# Altium project DM1097_R1M1E1.PrjPcb (part 12 of 12)

## Sheet DM1097_IMU.SchDoc: =project_title
size Tabloid; CompanyName: Luxonis Holding; DrawnBy: David Malovrh; Organization: Luxonis Holding; Address1: 1925 Harmony Park Drive; Address2: Westminster, CO; Address3: 80234; Address4: United States; DocumentNumber: D0000200; Revision: R1M1E1; SheetNumber: 10; SheetTotal: 12
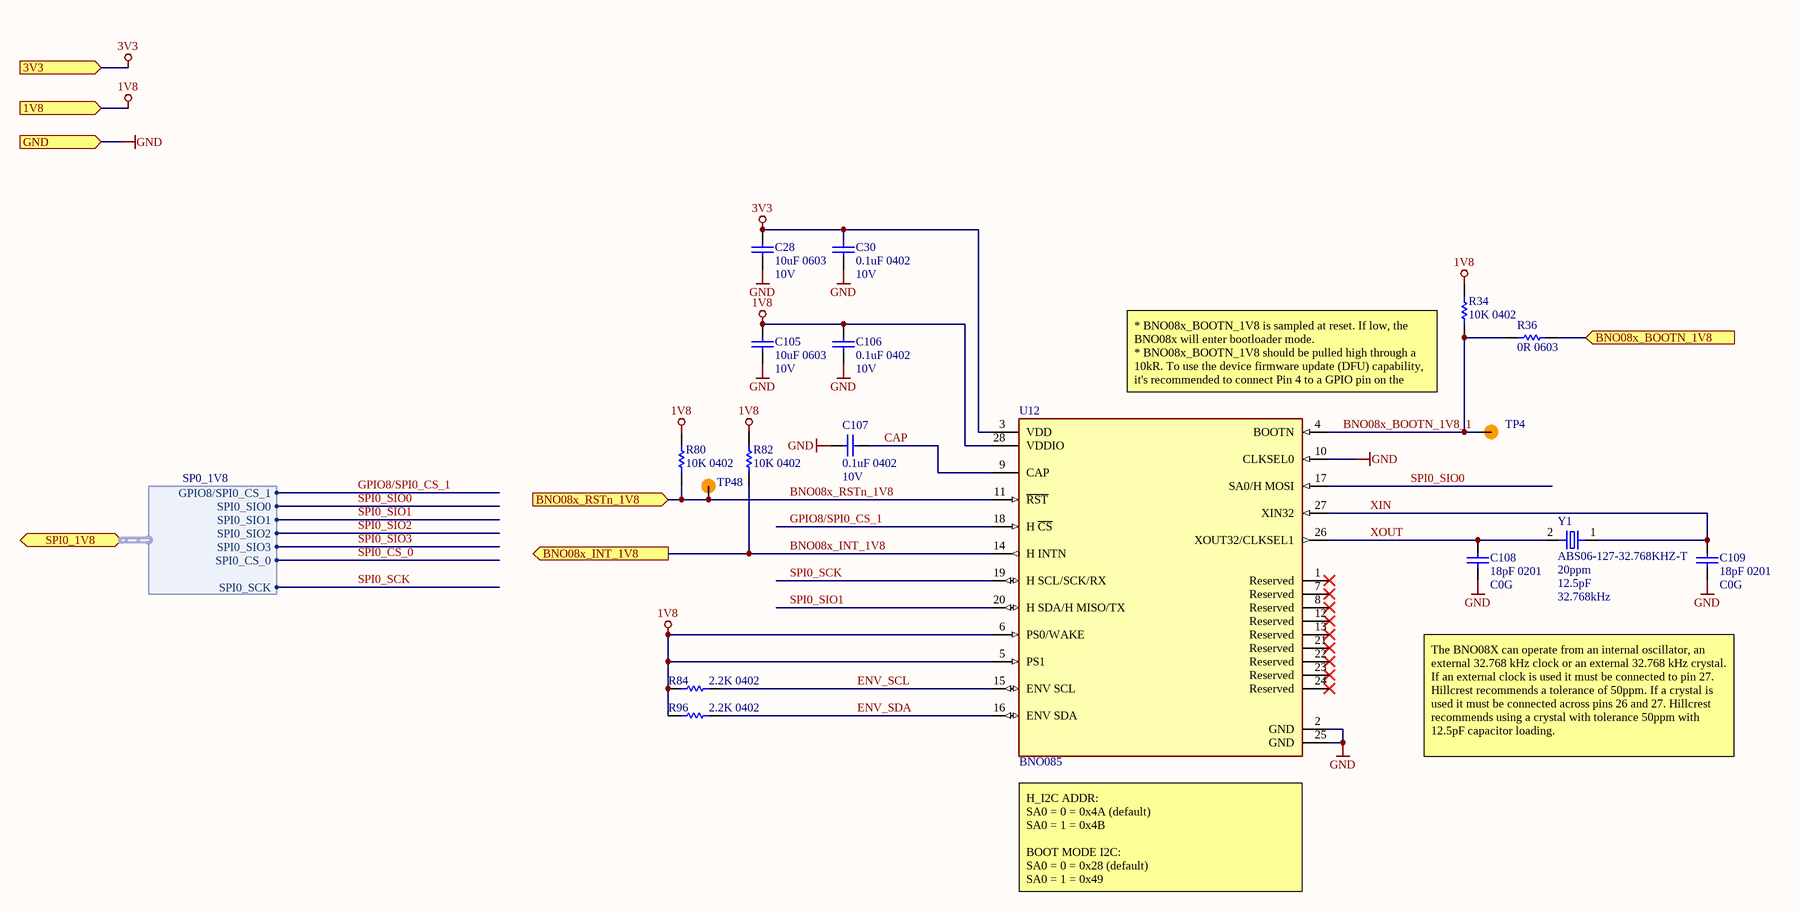
[diagram p16: DM1097_IMU.SchDoc]

### Parts
C28  10uF 0603  Voltage Rating: 10V  [CAPC0603(1608)100_N]
C30  0.1uF 0402  Voltage Rating: 10V  [CAPC0402(1005)70_N]
C105  10uF 0603  Voltage Rating: 10V  [CAPC0603(1608)100_N]
C106  0.1uF 0402  Voltage Rating: 10V  [CAPC0402(1005)70_N]
C107  0.1uF 0402  Voltage Rating: 10V  [CAPC0402(1005)70_N]
C108  18pF 0201  Dielectric: C0G  [CAPC0201(0603)33_N]
C109  18pF 0201  Dielectric: C0G  [CAPC0201(0603)33_N]
R34  10K 0402  [RESC0402(1005)_N]
R36  0R 0603  [RESC0603(1608)_N]
R80  10K 0402  [RESC0402(1005)_N]
R82  10K 0402  [RESC0402(1005)_N]
R84  2.2K 0402  [RESC0402(1005)_N]
R96  2.2K 0402  [RESC0402(1005)_N]
TP4  TP100_200_NS  [TP100_200_NS]  (value not drawn)  (no BOM)
TP48  TP100_200_NS  [TP100_200_NS]  (value not drawn)  (no BOM)
U12  BNO085  [BNO085]
Y1  ABS06-127-32.768KHZ-T  Frequency Tolerance: 20ppm  Load Capacitance: 12.5pF  Frequency: 32.768kHz  [ABS06-127-32.768KHZ-T]

### Ports
1V8 (in), 3V3 (in), BNO08x_BOOTN_1V8 (in), BNO08x_INT_1V8 (out), BNO08x_RSTn_1V8 (in), GND (in), SPI0_1V8 (bidir, harness SP0_1V8)

### Harnesses
SP0_1V8: SPI0_SIO1, SPI0_SIO2, SPI0_SIO3, GPIO8/SPI0_CS_1, SPI0_SIO0, SPI0_CS_0, SPI0_SCK

### Nets
1V8: C105.2 C106.2 R34.2 R80.2 R82.2 R84.1 R96.1 U12.5(PS1) U12.6(PS0/WAKE) U12.28(VDDIO) ; port 1V8
3V3: C28.2 C30.2 U12.3(VDD) ; port 3V3
GND: C28.1 C30.1 C105.1 C106.1 C107.2 C108.1 C109.1 U12.2(GND) U12.10(CLKSEL0) U12.25(GND) ; port GND
BNO08x_BOOTN_1V8_1: R34.1 R36.1 TP4.1 U12.4(BOOTN)
BNO08x_INT_1V8: R82.1 U12.14(H_INTN) ; port BNO08x_INT_1V8  [project net AUX_IO_IRQ]
BNO08x_RSTn_1V8: R80.1 TP48.1 U12.11(~{RST}) ; port BNO08x_RSTn_1V8
CAP: C107.1 U12.9(CAP)
ENV_SCL: R84.2 U12.15(ENV_SCL)
ENV_SDA: R96.2 U12.16(ENV_SDA)
GPIO8/SPI0_CS_1: U12.18(H_~{CS}) ; port SPI0_1V8.GPIO8/SPI0_CS_1
SPI0_SCK: U12.19(H_SCL/SCK/RX) ; port SPI0_1V8.SPI0_SCK
SPI0_SIO0: U12.17(SA0/H_MOSI) ; port SPI0_1V8.SPI0_SIO0
SPI0_SIO1: U12.20(H_SDA/H_MISO/TX) ; port SPI0_1V8.SPI0_SIO1
XIN: C109.2 U12.27(XIN32) Y1.1
XOUT: C108.2 U12.26(XOUT32/CLKSEL1) Y1.2
NetJ21_42: R36.2 ; port BNO08x_BOOTN_1V8

Not connected (* = marked no-connect by the designer): U12 1(Reserved)* 7(Reserved)* 8(Reserved)* 12(Reserved)* 13(Reserved)* 21(Reserved)* 22(Reserved)* 23(Reserved)* 24(Reserved)*

### Notes on the sheet
- * BNO08x_BOOTN_1V8 is sampled at reset. If low, the BNO08x will enter bootloader mode.
  * BNO08x_BOOTN_1V8 should be pulled high through a 10kR. To use the device firmware update (DFU) capability, it's recommended to connect Pin 4 to a GPIO pin on the external uC.
- The BNO08X can operate from an internal oscillator, an external 32.768 kHz clock or an external 32.768 kHz crystal. If an external clock is used it must be connected to pin 27. Hillcrest recommends a tolerance of 50ppm. If a crystal is used it must be connected across pins 26 and 27. Hillcrest recommends using a crystal with tolerance 50ppm with 12.5pF capacitor loading.
- (near U12) H_I2C ADDR:
  SA0 = 0 = 0x4A (default)
  SA0 = 1 = 0x4B
  BOOT MODE I2C:
  SA0 = 0 = 0x28 (default)
  SA0 = 1 = 0x49
- Title
- Size:
- Date:
- Tabloid
- Number:
- Time:
- Revision:
- Sheet
- of
- Drawn by:

### Library data of the parts
C28 C105 = GRM188R61A106ME69D: CAP CER 10UF 10V X5R 0603 20%; Manufacturer 1: Murata; Material: Ceramic; Supplier 1: Digi-Key; Manufacturer Part Number 1: GRM188R61A106ME69D; Stock 1: 2873098; Pricing 1: 1=0.21000, 10=0.14100, 100=0.07130, 500=0.04876, 1000=0.04313 (USD); RoHS: Yes; Mount: Surface Mount; Case/Package: 0603; Weight: 0.000222oz; Case Code (Metric): 1608; Case Code (Imperial): 0603; Min Operating Temperature: -55°C; Max Operating Temperature: 85°C; Packaging: Tape and Reel; Tolerance: 20%; Capacitance: 10uF; Dielectric: X5R; Voltage Rating (DC): 10V; Package Quantity: 4000; Termination: SMD/SMT; Length: 1.6mm; Height: 0.8mm; Width: 0.8mm; Thickness: 0.035inch; Depth: 0.8mm; REACH SVHC: Unknown; Lead Free: Lead Free; ComponentLink1URL: http://www.mouser.com/ds/2/281/c02e-2905.pdf?src-supplier=Mouser; ComponentLink1Description: http://www.mouser.com/ds/2/281/c02e-2905.pdf?src-supplier=Mouser; ComponentLink2URL: http://components.arrow.com/part/dataview/0323_06119472?src-supplier=Arrow+Europe; ComponentLink2Description: http://components.arrow.com/part/dataview/0323_06119472?src-supplier=Arrow+Europe; ComponentLink3URL: http://www.farnell.com/datasheets/2048014.pdf?src-supplier=Farnell; ComponentLink3Description: http://www.farnell.com/datasheets/2048014.pdf?src-supplier=Farnell; ComponentLink4URL: http://www.farnell.com/datasheets/1872210.pdf?src-supplier=Farnell; ComponentLink4Description: http://www.farnell.com/datasheets/1872210.pdf?src-supplier=Farnell; ComponentLink5URL: http://search.murata.co.jp/Ceramy/image/img/A01X/G101/ENG/GRM188R61A106ME69-01.pdf?src-supplier=Digi-Key; ComponentLink5Description: http://search.murata.co.jp/Ceramy/image/img/A01X/G101/ENG/GRM188R61A106ME69-01.pdf?src-supplier=Digi-Key; ComponentLink6URL: http://www.farnell.com/datasheets/1872210.pdf?src-supplier=Newark; ComponentLink6Description: http://www.farnell.com/datasheets/1872210.pdf?src-supplier=Newark; ComponentLink7URL: http://www.farnell.com/datasheets/2048014.pdf?src-supplier=Element14; ComponentLink7Description: http://www.farnell.com/datasheets/2048014.pdf?src-supplier=Element14; ComponentLink8URL: http://www.farnell.com/datasheets/2048014.pdf?src-supplier=Newark; ComponentLink8Description: http://www.farnell.com/datasheets/2048014.pdf?src-supplier=Newark; Supplier Part Number 1: 490-10475-1-ND
C30 C106 C107 = GRM155R71A104JA01D: CAP CER 0.1UF 10V X7R 0402 5%; Manufacturer 1: Murata; Capacitance: 100nF; Supplier 1: Digi-Key; Manufacturer Part Number 1: GRM155R71A104JA01D; Stock 1: 1346709; Pricing 1: 1=0.10000, 10=0.02500, 100=0.01130, 500=0.00806, 1000=0.00633, 2500=0.00575, 5000=0.00529 (USD); RoHS: Yes; Mount: Surface Mount; Case/Package: 0402; Case Code (Imperial): 0402; Case Code (Metric): 1005; Min Operating Temperature: -55°C; Max Operating Temperature: 125°C; Tolerance: 5%; Packaging: Tape and Reel; Voltage Rating (DC): 10V; Dielectric: X7R; Package Quantity: 10000; Termination: SMD/SMT; Length: 1mm; Height: 0.5mm; Width: 0.02inch; Thickness: 0.022inch; Depth: 0.5mm; Radiation Hardening: No; Lead Free: Lead Free; ComponentLink1URL: https://datasheet.ciiva.com/5411/product-5411135.pdf?src-supplier=Mouser; ComponentLink1Description: https://datasheet.ciiva.com/5411/product-5411135.pdf?src-supplier=Mouser; ComponentLink2URL: https://datasheet.ciiva.com/11618/c02e-11618821.pdf?src-supplier=Avnet; ComponentLink2Description: https://datasheet.ciiva.com/11618/c02e-11618821.pdf?src-supplier=Avnet; Supplier Part Number 1: 490-10777-1-ND
C108 C109 = GRM0335C1E180FA01D: Cap Ceramic 18pF 25V C0G 1% Pad SMD 0201 125C T/R; Manufacturer 1: Murata; Supplier 1: Digi-Key; Manufacturer Part Number 1: GRM0335C1E180FA01D; RoHS: Yes; Category: Ceramic Capacitors; Stock 1: 27511; Pricing 1: 1=0.10000, 10=0.02100, 100=0.00930, 500=0.00666, 1000=0.00523, 2500=0.00476, 5000=0.00438 (USD); Mount: Surface Mount; Case/Package: 0201; Case Code (Imperial): 0201; Case Code (Metric): 0603; Min Operating Temperature: -55°C; Max Operating Temperature: 125°C; Capacitance: 18pF; Tolerance: 1%; Packaging: Tape and Reel; Voltage Rating (DC): 25V; Package Quantity: 15000; Voltage Rating: 25V; Termination: SMD/SMT; Length: 0.024inch; Height: 0.3mm; Thickness: 0.013inch; Width: 0.3mm; ComponentLink1URL: https://datasheet.ciiva.com/29538/partnumbering-e-01-29538328.pdf?src-supplier=Digi-Key; ComponentLink1Description: https://datasheet.ciiva.com/29538/partnumbering-e-01-29538328.pdf?src-supplier=Digi-Key; Supplier 2: Digi-Key; Supplier 3: Mouser; Supplier Part Number 3: 81-GRM0335C1E180FA1D; Supplier Part Number 2: 490-17804-2-ND; Supplier Part Number 1: 490-17804-1-ND
R34 R80 R82 = RC0402FR-1310KL: RES SMD 10K OHM 1% 0402 1/16W Chip Resistor, 0402 [1005 Metric], 10 kohm, RC Series, 50 V, Thick Film, 62.5 mW; Manufacturer 1: Yageo; Resistance: 10kR; Temperature Coefficient: 100ppm/°C; Power Rating: 62.5mW; Voltage Rating: 50V; ComponentLink1URL: https://datasheet.ciiva.com/16940/pyu-rc0402-51-rohs-l-6-16940293.pdf?src-supplier=Avnet+Europe; ComponentLink1Description: https://datasheet.ciiva.com/16940/pyu-rc0402-51-rohs-l-6-16940293.pdf?src-supplier=Avnet+Europe; ComponentLink2URL: https://datasheet.ciiva.com/28386/pyu-rc0402-51-rohs-l-6-28386855.pdf?src-supplier=Avnet+Europe; ComponentLink2Description: https://datasheet.ciiva.com/28386/pyu-rc0402-51-rohs-l-6-28386855.pdf?src-supplier=Avnet+Europe; ComponentLink3URL: https://datasheet.ciiva.com/16740/pyu-rc0402-51-rohs-l-6-r-16740602.pdf?src-supplier=Future+Electronics; ComponentLink3Description: https://datasheet.ciiva.com/16740/pyu-rc0402-51-rohs-l-6-r-16740602.pdf?src-supplier=Future+Electronics; ComponentLink4URL: https://datasheet.ciiva.com/8891/pyu-rc0402-51-rohs-l-6-8891339.pdf?src-supplier=Avnet; ComponentLink4Description: https://datasheet.ciiva.com/8891/pyu-rc0402-51-rohs-l-6-8891339.pdf?src-supplier=Avnet; ComponentLink5URL: https://datasheet.ciiva.com/5557/pyu-rc0402-51-rohs-l-6-r-5557997.pdf?src-supplier=Mouser; ComponentLink5Description: https://datasheet.ciiva.com/5557/pyu-rc0402-51-rohs-l-6-r-5557997.pdf?src-supplier=Mouser; ComponentLink6URL: https://datasheet.ciiva.com/7983/1018594-7983533.pdf?src-supplier=Element14; ComponentLink6Description: https://datasheet.ciiva.com/7983/1018594-7983533.pdf?src-supplier=Element14; Supplier 1: Newark; Manufacturer Part Number 1: RC0402FR-1310KL; Stock 1: 62239; Pricing 1: 1=0.10000, 25=0.01200, 100=0.00400, 250=0.00400, 500=0.00300, 1000=0.00300 (USD); RoHS: Yes; Case/Package: 0402; Number of Pins: 2; Contact Plating: Tin,Matte,Lead; Case Code (Imperial): 0402; Case Code (Metric): 1005; Min Operating Temperature: -55°C; Max Operating Temperature: 155°C; Tolerance: 1%; Composition: Thick Film; Packaging: Tape and Reel; Termination: SMD/SMT; Military Standard: Not; Voltage Rating (DC): 50V; Working Voltage: 50V; Number of Terminations: 2; Length: 1mm; Depth: 0.5mm; Radiation Hardening: No; REACH SVHC: No SVHC; Lead Free: Lead Free; Supplier Part Number 1: 67R9960; Supplier 2: Future Electronics; Supplier 3: Mouser; Supplier 4: Element14; Supplier Part Number 2: RC0402FR-1310KL-CUTT; Supplier Part Number 3: 603-RC0402FR-1310KL; Supplier Part Number 4: 1799235
R36 = CRCW06030000Z0EA: RES SMD 0 OHM JUMPER 1/10W 0603 0 Ohms Jumper 0.1W, 1/10W Chip Resistor 0603 (1608 Metric) Automotive AEC-Q200 Thick Film; Manufacturer 1: Vishay; Manufacturer Part Number 1: CRCW0603-0000Z0EA; Resistance: 0mR; Power Rating: 100mW; Voltage Rating: 75V; Temperature Coefficient: 100ppm/°C; Tolerance: 5%; Current Rating: 2A; Supplier 1: Digi-Key; Stock 1: 742743; Pricing 1: 1=0.100000, 10=0.034000, 25=0.024400, 50=0.018600, 100=0.013800, 250=0.010480, 500=0.008400, 1000=0.006180 (USD); RoHS: Yes; Mount: Surface Mount; Case/Package: 0603; Weight: 7.1E-05oz; Contact Plating: Tin,Lead; Case Code (Metric): 1608; Case Code (Imperial): 0603; Min Operating Temperature: -55°C; Max Operating Temperature: 155°C; Composition: Thick Film; Termination: SMD/SMT; Packaging: Tape and Reel; Package Quantity: 1; Number of Terminations: 2; Military Standard: Not; Max Power Dissipation: 100mW; Voltage Rating (DC): 75V; Features: Automotive AEC-Q200; Working Voltage: 75V; Length: 1.55mm; Height: 0.02inch; Width: 0.033inch; Depth: 0.85mm; Radiation Hardening: No; Lead Free: Lead Free; REACH SVHC: Unknown; ComponentLink1URL: https://datasheet.ciiva.com/2461/dcrcwe3-2461968.pdf?src-supplier=Digi-Key; ComponentLink1Description: https://datasheet.ciiva.com/2461/dcrcwe3-2461968.pdf?src-supplier=Digi-Key; ComponentLink2URL: https://datasheet.ciiva.com/2461/dcrcwe3-2461969.pdf?src-supplier=Digi-Key; ComponentLink2Description: https://datasheet.ciiva.com/2461/dcrcwe3-2461969.pdf?src-supplier=Digi-Key; ComponentLink3URL: https://datasheet.ciiva.com/2461/dcrcwe3-2461970.pdf?src-supplier=Digi-Key; ComponentLink3Description: https://datasheet.ciiva.com/2461/dcrcwe3-2461970.pdf?src-supplier=Digi-Key; ComponentLink4URL: https://datasheet.ciiva.com/8340/dcrcwe3-8340197.pdf?src-supplier=Avnet; ComponentLink4Description: https://datasheet.ciiva.com/8340/dcrcwe3-8340197.pdf?src-supplier=Avnet; ComponentLink5URL: https://datasheet.ciiva.com/16941/dcrcw-16941302.pdf?src-supplier=Avnet+Europe; ComponentLink5Description: https://datasheet.ciiva.com/16941/dcrcw-16941302.pdf?src-supplier=Avnet+Europe; ComponentLink6URL: https://datasheet.ciiva.com/16199/dcrcwe3-16199063.pdf?src-supplier=Future+Electronics; ComponentLink6Description: https://datasheet.ciiva.com/16199/dcrcwe3-16199063.pdf?src-supplier=Future+Electronics; ComponentLink7URL: https://datasheet.ciiva.com/16725/70201119-16725175.pdf?src-supplier=Allied+Electronics; ComponentLink7Description: https://datasheet.ciiva.com/16725/70201119-16725175.pdf?src-supplier=Allied+Electronics; ComponentLink8URL: https://datasheet.ciiva.com/26316/fld-crcw-e3-data-en-26316615.pdf?src-supplier=Distrelec; ComponentLink8Description: https://datasheet.ciiva.com/26316/fld-crcw-e3-data-en-26316615.pdf?src-supplier=Distrelec; ComponentLink9URL: https://datasheet.ciiva.com/5544/dcrcwe3-109170-5544344.pdf?src-supplier=Mouser; ComponentLink9Description: https://datasheet.ciiva.com/5544/dcrcwe3-109170-5544344.pdf?src-supplier=Mouser; ComponentLink10URL: https://datasheet.ciiva.com/7841/1720486-7841816.pdf?src-supplier=Element14; ComponentLink10Description: https://datasheet.ciiva.com/7841/1720486-7841816.pdf?src-supplier=Element14; ComponentLink11URL: https://datasheet.ciiva.com/7841/1720486-7841817.pdf?src-supplier=Element14; ComponentLink11Description: https://datasheet.ciiva.com/7841/1720486-7841817.pdf?src-supplier=Element14; ComponentLink12URL: https://datasheet.ciiva.com/7841/125364-7841818.pdf?src-supplier=Element14; ComponentLink12Description: https://datasheet.ciiva.com/7841/125364-7841818.pdf?src-supplier=Element14; ComponentLink13URL: https://datasheet.ciiva.com/16721/70201119-16721450.pdf?src-supplier=Allied+Electronics; ComponentLink13Description: https://datasheet.ciiva.com/16721/70201119-16721450.pdf?src-supplier=Allied+Electronics; Supplier Part Number 1: 541-0.0GCT-ND
R84 R96 = RC0402FR-072K2L: RES SMD 2.2K OHM 1% 1/16W 0402; Manufacturer 1: Yageo; Resistance: 2.2kR; Temperature Coefficient: 100ppm/°C; Power Rating: 63mW; Voltage Rating: 50V; Supplier 1: Digi-Key; Manufacturer Part Number 1: RC0402FR-072K2L; Stock 1: 12579098; Pricing 1: 1=0.10000, 10=0.01600, 100=0.00640, 1000=0.00289, 2500=0.00251, 5000=0.00207 (USD); RoHS: Yes; Case/Package: 0402; Weight: 2.3E-05oz; Case Code (Imperial): 0402; Case Code (Metric): 1005; Min Operating Temperature: -55°C; Max Operating Temperature: 155°C; Packaging: Tape and Reel; Tolerance: 1%; Composition: Thick Film; Termination: SMD/SMT; Military Standard: Not; Length: 1mm; Height: 0.35mm; Width: 0.5mm; Depth: 0.5mm; Lead Free: Lead Free; REACH SVHC: Unknown; ComponentLink1URL: https://datasheet.ciiva.com/11808/0900766b80c66297-11808786.pdf?src-supplier=RSComponents; ComponentLink1Description: https://datasheet.ciiva.com/11808/0900766b80c66297-11808786.pdf?src-supplier=RSComponents; ComponentLink2URL: https://datasheet.ciiva.com/12577/pyu-rc0402-51-rohs-l-6-r-12577429.pdf?src-supplier=Mouser; ComponentLink2Description: https://datasheet.ciiva.com/12577/pyu-rc0402-51-rohs-l-6-r-12577429.pdf?src-supplier=Mouser; ComponentLink3URL: https://datasheet.ciiva.com/16741/pyu-rc0402-51-rohs-l-6-r-16741015.pdf?src-supplier=Future+Electronics; ComponentLink3Description: https://datasheet.ciiva.com/16741/pyu-rc0402-51-rohs-l-6-r-16741015.pdf?src-supplier=Future+Electronics; ComponentLink4URL: https://datasheet.ciiva.com/7983/1018594-7983515.pdf?src-supplier=Element14; ComponentLink4Description: https://datasheet.ciiva.com/7983/1018594-7983515.pdf?src-supplier=Element14; ComponentLink5URL: https://datasheet.ciiva.com/46383/1018594-46383563.pdf?src-supplier=Element14; ComponentLink5Description: https://datasheet.ciiva.com/46383/1018594-46383563.pdf?src-supplier=Element14; ComponentLink6URL: https://datasheet.ciiva.com/7849/1018594-7849928.pdf?src-supplier=Element14; ComponentLink6Description: https://datasheet.ciiva.com/7849/1018594-7849928.pdf?src-supplier=Element14; ComponentLink7URL: https://datasheet.ciiva.com/7849/1018594-7849929.pdf?src-supplier=Element14; ComponentLink7Description: https://datasheet.ciiva.com/7849/1018594-7849929.pdf?src-supplier=Element14; Supplier 2: Mouser; Supplier 3: Newark; Supplier Part Number 1: 311-2.20KLRCT-ND; Supplier Part Number 2: 603-RC0402FR-072K2L; Supplier Part Number 3: 98K7523
TP4 TP48 = TEST_POINT
U12 = BNO085: IMU ACCEL/GYRO/MAG I2C 32BIT; Manufacturer 1: Hillcrest Laboratories; Sensor Type: Accelerometer,Gyroscope,Magnetometer; Output Type: SPI,I2C; Supplier 1: Digi-Key; Manufacturer Part Number 1: BNO085; RoHS: No; Category: Inertial Measurement Units (IMUs); Stock 1: 11593; Pricing 1: 1=11.85000, 5=10.31200, 10=9.28100, 25=8.25000, 50=7.63120, 100=6.60000, 500=6.18750, 1000=5.77500 (USD); Mount: Surface Mount; Case/Package: LGA; Min Operating Temperature: -40°C; Max Operating Temperature: 85°C; Packaging: Tape and Reel; ComponentLink1URL: https://www.hillcrestlabs.com/downloads/bno080-datasheet?src-supplier=Digi-Key; ComponentLink1Description: https://www.hillcrestlabs.com/downloads/bno080-datasheet?src-supplier=Digi-Key; ComponentLink2URL: https://www.hillcrestlabs.com/downloads/bno080-migration-guide?src-supplier=Digi-Key; ComponentLink2Description: https://www.hillcrestlabs.com/downloads/bno080-migration-guide?src-supplier=Digi-Key; Supplier Part Number 1: 1888-1006-1-ND
Y1 = ABS06-127-32.768KHZ-T: CRYSTAL 32.768kHz ±20ppm Crystal 12.5pF 90 kOhms 2-SMD, No Lead; Manufacturer 1: Abracon; ESR (Equivalent Series Resistance): 90kR; Supplier 1: Digi-Key; Manufacturer Part Number 1: ABS06-127-32.768KHZ-T; RoHS: Yes; Stock 1: 1640; Pricing 1: 1=0.69000, 10=0.60700, 50=0.56760, 100=0.50160, 500=0.47520, 1000=0.39600 (USD); Mount: Surface Mount; Case/Package: SMD/SMT; Min Operating Temperature: -40°C; Max Operating Temperature: 85°C; Packaging: Tape and Reel; ComponentLink1URL: http://www.farnell.com/datasheets/2614114.pdf?src-supplier=Farnell; ComponentLink1Description: http://www.farnell.com/datasheets/2614114.pdf?src-supplier=Farnell; ComponentLink2URL: https://abracon.com/datasheets/ABS06-127-32.768kHz-T.pdf?src-supplier=Digi-Key; ComponentLink2Description: https://abracon.com/datasheets/ABS06-127-32.768kHz-T.pdf?src-supplier=Digi-Key; ComponentLink3URL: http://www.farnell.com/datasheets/2614114.pdf?src-supplier=Newark; ComponentLink3Description: http://www.farnell.com/datasheets/2614114.pdf?src-supplier=Newark; Supplier 2: Digi-Key; Supplier 3: Mouser; Supplier 4: Verical; Supplier Part Number 1: 535-14513-1-ND; Supplier Part Number 2: 535-14513-6-ND; Supplier Part Number 3: 815-ABS0612732.768KT; Supplier Part Number 4: ABS06-127-32.768KHZ-T

## Nets that join several sheets
1V2: DM1097_RIGHT_OV9282 (FB9.1), DM1097_LEFT_OV9282 (FB8.1), DM1097_Power_Supply (C39.2 U8.5)
1V05: DM1097_IMX378 (FB3.1), DM1097_HUB (15 pins), DM1097_Power_Supply (6 pins)
1V8: DM1097_IMX378 (FB2.1), DM1097_CM4 (R9.2 R63.1), DM1097_BOOT_AUX_uSD (13 pins), DM1097_RIGHT_OV9282 (FB7.1), DM1097_LEFT_OV9282 (FB6.1), DM1097_Power_Supply (5 pins), DM1097_HDMI (R27.2), DM1097_IMU (10 pins)
2V8: DM1097_IMX378 (FB1.1), DM1097_RIGHT_OV9282 (FB5.1), DM1097_LEFT_OV9282 (FB4.1), DM1097_Power_Supply (C42.2 U9.5)
3V3: DM1097_CM4 (8 pins), DM1097_BOOT_AUX_uSD (C87.2 J22.9 J23.4), DM1097_HUB (30 pins), DM1097_RJ45 (D17.2 J4.15 J4.17), DM1097_Power_Supply (8 pins), DM1097_HDMI (R26.2), DM1097_IMU (C28.2 C30.2 U12.3)
5V_PoE: DM1097_Power_Supply (R62.2 R65.2), DM1097_PoE (7 pins)
GND: DM1097_IMX378 (16 pins), DM1097_CM4 (29 pins), DM1097_BOOT_AUX_uSD (15 pins), DM1097_BootSel (J2.3 Q1.2 R2.1), DM1097_HUB (52 pins), DM1097_RJ45 (7 pins), DM1097_RIGHT_OV9282 (16 pins), DM1097_LEFT_OV9282 (16 pins), DM1097_Power_Supply (44 pins), DM1097_HDMI (12 pins), DM1097_CM4_HS (31 pins), DM1097_PoE (9 pins), DM1097_Connector_B (28 pins), DM1097_Connector_A (46 pins), DM1097_IMU (10 pins)
VBUSB: DM1097_BootSel (J2.1), DM1097_HUB (J12.1)
VDD_5V: DM1097_CM4 (7 pins), DM1097_HUB (R42.2 U6.7), DM1097_Power_Supply (23 pins), DM1097_HDMI (C10.2 U1.3), DM1097_Connector_B (10 pins), DM1097_Connector_A (R21.2 R108.2)
VNEG_IN: DM1097_RJ45 (D7.4 D8.4), DM1097_PoE (C52.1 FB11.1)
AUX_IO_IRQ: DM1097_Connector_A (J1.69), DM1097_IMU (R82.1 U12.14)
BNO08x_RSTn_1V8: DM1097_Connector_B (J21.44), DM1097_IMU (R80.1 TP48.1 U12.11)
BOOT0: DM1097_BOOT_AUX_uSD (R86.1 R117.2 SW1.6), DM1097_Connector_B (J21.26)
BOOT1: DM1097_BOOT_AUX_uSD (R85.1 R115.2 SW1.5), DM1097_Connector_B (J21.24)
BOOT2: DM1097_BOOT_AUX_uSD (R79.1 R114.2 SW1.4), DM1097_Connector_B (J21.22)
BOOT3: DM1097_BOOT_AUX_uSD (R78.1 R116.2 SW1.3), DM1097_Connector_B (J21.20)
BOOT4: DM1097_BOOT_AUX_uSD (R77.1 R113.2 SW1.2), DM1097_Connector_B (J21.18)
CAM_A_CLK_OUT: DM1097_IMX378 (J11.30), DM1097_Connector_A (J1.28)
CAM_A_PWDN_N: DM1097_IMX378 (J11.23 R28.1), DM1097_Connector_A (J1.34)
CAM_B_CLK_OUT: DM1097_RIGHT_OV9282 (J19.24), DM1097_LEFT_OV9282 (J18.24), DM1097_Connector_A (J1.73)
CAM_B_D_PWM: DM1097_RIGHT_OV9282 (J19.22 R35.1), DM1097_Connector_A (J1.65)
CAM_B_PWDN_N: DM1097_LEFT_OV9282 (J18.22 R33.1), DM1097_Connector_A (J1.67)
CM_USB_D_N: DM1097_HUB (J12.2), DM1097_CM4_HS (J13.3)
CM_USB_D_P: DM1097_HUB (J12.3), DM1097_CM4_HS (J13.5)
COM_AUX_IO2: DM1097_LEFT_OV9282 (R37.1), DM1097_Connector_A (J1.42 TP10.1)
ETH_LEDG: DM1097_CM4 (J9.15), DM1097_RJ45 (R3.1)
ETH_LEDY: DM1097_CM4 (J9.17), DM1097_RJ45 (R1.1)
ETH_LEDY2: DM1097_CM4 (J9.19), DM1097_RJ45 (R5.1)
FSIN2: DM1097_RIGHT_OV9282 (J19.18), DM1097_LEFT_OV9282 (R83.2)
GPIO1/MRST: DM1097_CM4 (J9.35), DM1097_Connector_A (R18.1)
GPIO8/SPI0_CS_1: DM1097_Connector_A (J1.60 TP19.1), DM1097_IMU (U12.18)
GPIO58: DM1097_BOOT_AUX_uSD (R76.1 R118.2 SW1.1), DM1097_Connector_B (J21.28)
HDMI_CEC: DM1097_HDMI (Q3.2 R26.1), DM1097_CM4_HS (J13.51)
HDMI_CLK_N: DM1097_HDMI (J10.14), DM1097_CM4_HS (J13.90)
HDMI_CLK_P: DM1097_HDMI (J10.12), DM1097_CM4_HS (J13.88)
HDMI_D0_N: DM1097_HDMI (J10.11), DM1097_CM4_HS (J13.84)
HDMI_D0_P: DM1097_HDMI (J10.9), DM1097_CM4_HS (J13.82)
HDMI_D1_N: DM1097_HDMI (J10.8), DM1097_CM4_HS (J13.78)
HDMI_D1_P: DM1097_HDMI (J10.6), DM1097_CM4_HS (J13.76)
HDMI_D2_N: DM1097_HDMI (J10.5), DM1097_CM4_HS (J13.72)
HDMI_D2_P: DM1097_HDMI (J10.3), DM1097_CM4_HS (J13.70)
HDMI_HPD_N_1V8: DM1097_HDMI (Q4.3 R27.1), DM1097_CM4_HS (J13.53)
HDMI_SCL: DM1097_HDMI (J10.17 R59.1 U2.3), DM1097_CM4_HS (J13.100)
HDMI_SDA: DM1097_HDMI (J10.18 R60.1 U2.4), DM1097_CM4_HS (J13.99)
I2C1_SCL: DM1097_IMX378 (J11.20), DM1097_Connector_A (J1.35)
I2C1_SDA: DM1097_IMX378 (J11.19), DM1097_Connector_A (J1.33)
I2C2_SCL: DM1097_RIGHT_OV9282 (J19.21), DM1097_LEFT_OV9282 (J18.21), DM1097_Connector_A (J1.77)
I2C2_SDA: DM1097_RIGHT_OV9282 (J19.20), DM1097_LEFT_OV9282 (J18.20), DM1097_Connector_A (J1.79)
MIPI_RX2_C_N: DM1097_LEFT_OV9282 (J18.11), DM1097_Connector_A (J1.95)
MIPI_RX2_C_P: DM1097_LEFT_OV9282 (J18.10), DM1097_Connector_A (J1.97)
MIPI_RX2_D0_N: DM1097_LEFT_OV9282 (J18.8), DM1097_Connector_A (J1.89)
MIPI_RX2_D0_P: DM1097_LEFT_OV9282 (J18.7), DM1097_Connector_A (J1.91)
MIPI_RX2_D1_N: DM1097_LEFT_OV9282 (J18.5), DM1097_Connector_A (J1.83)
MIPI_RX2_D1_P: DM1097_LEFT_OV9282 (J18.4), DM1097_Connector_A (J1.85)
MIPI_RX3_C_N: DM1097_RIGHT_OV9282 (J19.11), DM1097_Connector_A (J1.96)
MIPI_RX3_C_P: DM1097_RIGHT_OV9282 (J19.10), DM1097_Connector_A (J1.98)
MIPI_RX3_D0_N: DM1097_RIGHT_OV9282 (J19.8), DM1097_Connector_A (J1.90)
MIPI_RX3_D0_P: DM1097_RIGHT_OV9282 (J19.7), DM1097_Connector_A (J1.92)
MIPI_RX3_D1_N: DM1097_RIGHT_OV9282 (J19.5), DM1097_Connector_A (J1.84)
MIPI_RX3_D1_P: DM1097_RIGHT_OV9282 (J19.4), DM1097_Connector_A (J1.86)
MIPI_RX4_C_N: DM1097_IMX378 (J11.28), DM1097_Connector_A (J1.3)
MIPI_RX4_C_P: DM1097_IMX378 (J11.27), DM1097_Connector_A (J1.5)
MIPI_RX4_D0_N: DM1097_IMX378 (J11.5), DM1097_Connector_A (J1.9)
MIPI_RX4_D0_P: DM1097_IMX378 (J11.6), DM1097_Connector_A (J1.11)
MIPI_RX4_D1_N: DM1097_IMX378 (J11.26), DM1097_Connector_A (J1.15)
MIPI_RX4_D1_P: DM1097_IMX378 (J11.25), DM1097_Connector_A (J1.17)
MIPI_RX5_D0_N: DM1097_IMX378 (J11.8), DM1097_Connector_A (J1.21)
MIPI_RX5_D0_P: DM1097_IMX378 (J11.9), DM1097_Connector_A (J1.23)
MIPI_RX5_D1_N: DM1097_IMX378 (J11.2), DM1097_Connector_A (J1.27)
MIPI_RX5_D1_P: DM1097_IMX378 (J11.3), DM1097_Connector_A (J1.29)
NetJ21_42: DM1097_Connector_B (J21.42), DM1097_IMU (R36.2)
nRPIBOOT: DM1097_CM4 (J9.93), DM1097_BootSel (Q1.3)
PCIE_CLK_N: DM1097_HUB (U3.22), DM1097_CM4_HS (J13.12)
PCIE_CLK_nREQ: DM1097_HUB (R47.1), DM1097_CM4_HS (J13.2)
PCIE_CLK_P: DM1097_HUB (U3.21), DM1097_CM4_HS (J13.10)
PCIE_nRST: DM1097_HUB (R45.1), DM1097_CM4_HS (J13.9)
PCIE_RX_N: DM1097_HUB (C70.1), DM1097_CM4_HS (J13.18)
PCIE_RX_P: DM1097_HUB (C69.1), DM1097_CM4_HS (J13.16)
PCIE_TX_N: DM1097_HUB (C72.1), DM1097_CM4_HS (J13.24)
PCIE_TX_P: DM1097_HUB (C71.1), DM1097_CM4_HS (J13.22)
SD_DETECT: DM1097_CM4 (J9.76), DM1097_BOOT_AUX_uSD (R52.2)
SD_PWR_ON: DM1097_CM4 (J9.75), DM1097_BOOT_AUX_uSD (TP13.1)
SDX_CLK: DM1097_CM4 (J9.57), DM1097_BOOT_AUX_uSD (J23.5)
SDX_CMD: DM1097_CM4 (J9.62), DM1097_BOOT_AUX_uSD (J23.3)
SDX_D0: DM1097_CM4 (J9.63), DM1097_BOOT_AUX_uSD (J23.7)
SDX_D1: DM1097_CM4 (J9.67), DM1097_BOOT_AUX_uSD (J23.8)
SDX_D2: DM1097_CM4 (J9.69), DM1097_BOOT_AUX_uSD (J23.1)
SDX_D3: DM1097_CM4 (J9.61), DM1097_BOOT_AUX_uSD (J23.2)
SPI0_SCK: DM1097_Connector_A (J1.74 TP17.1), DM1097_IMU (U12.19)
SPI0_SIO0: DM1097_Connector_A (J1.62 TP1.1), DM1097_IMU (U12.17)
SPI0_SIO1: DM1097_Connector_A (J1.64 TP3.1), DM1097_IMU (U12.20)
SSRX1_N: DM1097_HUB (U3.56), DM1097_Connector_B (J21.96)
SSRX1_P: DM1097_HUB (U3.55), DM1097_Connector_B (J21.98)
SSTX1_N: DM1097_HUB (C74.2), DM1097_Connector_B (J21.84)
SSTX1_P: DM1097_HUB (C73.2), DM1097_Connector_B (J21.86)
SYS_RST: DM1097_BOOT_AUX_uSD (J22.6), DM1097_Connector_B (J21.89)
TCK: DM1097_BOOT_AUX_uSD (J22.2), DM1097_Connector_B (J21.97)
TDI: DM1097_BOOT_AUX_uSD (J22.3), DM1097_Connector_B (J21.95)
TDO: DM1097_BOOT_AUX_uSD (J22.5), DM1097_Connector_B (J21.91)
TMS: DM1097_BOOT_AUX_uSD (J22.1), DM1097_Connector_B (J21.99)
TRD1_N: DM1097_CM4 (J9.10), DM1097_RJ45 (D1.1 D1.10 J4.2)
TRD1_P: DM1097_CM4 (J9.12), DM1097_RJ45 (D1.2 D1.9 J4.1)
TRD2_N: DM1097_CM4 (J9.6), DM1097_RJ45 (D1.4 D1.7 J4.6)
TRD2_P: DM1097_CM4 (J9.4), DM1097_RJ45 (D1.5 D1.6 J4.3)
TRD3_N: DM1097_CM4 (J9.9), DM1097_RJ45 (D2.5 D2.6 J4.8)
TRD3_P: DM1097_CM4 (J9.11), DM1097_RJ45 (D2.4 D2.7 J4.7)
TRD4_N: DM1097_CM4 (J9.5), DM1097_RJ45 (D2.2 D2.9 J4.10)
TRD4_P: DM1097_CM4 (J9.3), DM1097_RJ45 (D2.1 D2.10 J4.9)
TRST: DM1097_BOOT_AUX_uSD (J22.4), DM1097_Connector_B (J21.93)
USBD1_N: DM1097_HUB (U3.59), DM1097_Connector_B (J21.90)
USBD1_P: DM1097_HUB (U3.58), DM1097_Connector_B (J21.92)
VPOS_IN: DM1097_RJ45 (D7.1 D8.1), DM1097_PoE (C52.2 FB10.1)

## Assembly variants
Production SERIES: not fitted C75 C76 C77 C78 C79 C80 C90 C113 C114 C115 C116 D9 D10 J6 J14 J15 J16 J17 J20 J22 J24 J26 J27 J29 R9 R16 R26 R39 R42 R44 R52 R53 R58 R63 R65 R66 R69 R70 R71 R72 R73 R77 R79 R85 R87 R97 R98 R99 R102 R103 R104 R105 R106 R107 R110 R116 R117 R118 SW1 U6
Production SAMPLES: not fitted J14 J15 J16 J17 J20 J24 J26 J27 J29 R9 R16 R26 R39 R52 R53 R63 R65 R66 R104 R105 R113 R114 R115 R116 R117 R118